# EAGLE design hvac-sensors-v3 (EAGLE 6.4)
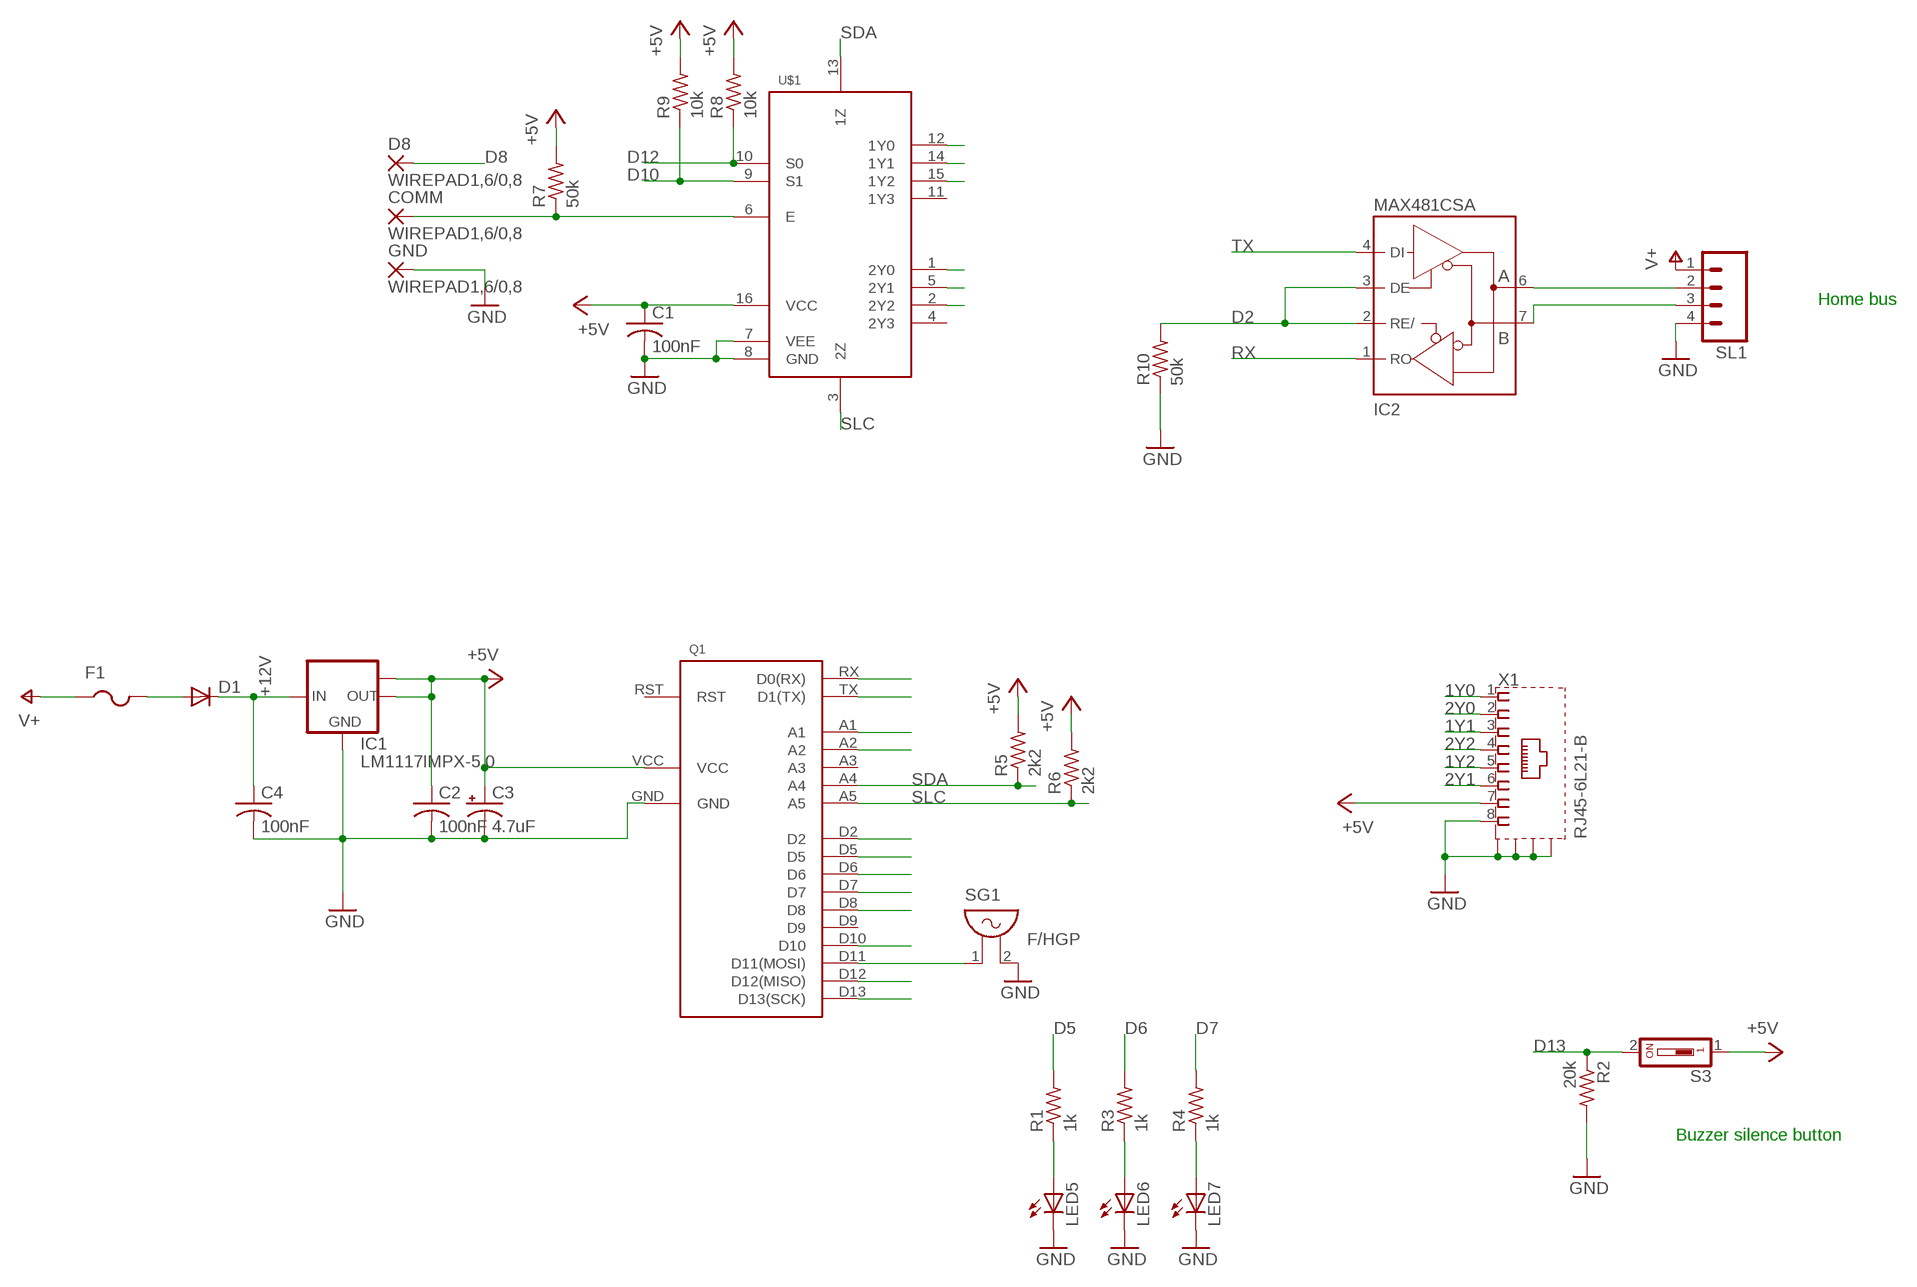
[diagram p0: schematic, sheet 1]

## Parts
C1  100nF  C-USC0603K  [C0603K]
C2  100nF  C-USC0603K  [C0603K]
C3  4.7uF  CPOL-USE1.8-4  [E1,8-4]
C4  100nF  C-USC0603K  [C0603K]
COMM  WIREPAD1,6/0,8  [1,6/0,8]
D1  DIODE-MICROMELF-W  [MICROMELF-W]
D8  WIREPAD1,6/0,8  [1,6/0,8]
F1  PTCFUSE-1812  [1812]
GND  WIREPAD1,6/0,8  [1,6/0,8]
IC1  LM1117IMPX-5.0  [SOT223]
IC2  MAX481CSA  [SO08]
LED5  LED5MM  [LED5MM]
LED6  LED5MM  [LED5MM]
LED7  LED5MM  [LED5MM]
Q1  HOME-CPU-V1  [HOME-CPU-V1]
R1  1k  R-US_R0603  [R0603]
R2  20k  R-US_R0603  [R0603]
R3  1k  R-US_R0603  [R0603]
R4  1k  R-US_R0603  [R0603]
R5  2k2  R-US_R0603  [R0603]
R6  2k2  R-US_R0603  [R0603]
R7  50k  R-US_R0603  [R0603]
R8  10k  R-US_R0603  [R0603]
R9  10k  R-US_R0603  [R0603]
R10  50k  R-US_R0603  [R0603]
S3  DS01  [DS-01]
SG1  F/HGP  [F/HGP]
SL1  M04  [04P]
U$1  74HC4052SO-16  [SO16]
X1  RJ45-6L21-B  [RJ45-SHIELD1]

## Nets
1Y0: U$1.12(1Y0) X1.1
1Y1: U$1.14(1Y1) X1.3
1Y2: U$1.15(1Y2) X1.5
2Y0: U$1.1(2Y0) X1.2
2Y1: U$1.5(2Y1) X1.6
2Y2: U$1.2(2Y2) X1.4
+12V: C4.1 D1.C IC1.3(IN)
A1: Q1.A1
A2: Q1.A2
D2: IC2.2(RE/) IC2.3(DE) Q1.D2 R10.2
D5: Q1.D5 R1.2
D6: Q1.D6 R3.2
D7: Q1.D7 R4.2
D8: D8.1(P) Q1.D8
D10: Q1.D10 R9.1 U$1.9(S1)
D11: Q1.D11(D11(MOSI)) SG1.1
D12: Q1.D12(D12(MISO)) R8.1 U$1.10(S0)
D13: Q1.D13(D13(SCK)) R2.1 S3.2
GND: C1.2 C2.2 C3.- C4.2 GND.1(P) IC1.1(GND) LED5.K(C) LED6.K(C) LED7.K(C) Q1.GND R2.2 R10.1 SG1.2 SL1.4 U$1.7(VEE) U$1.8(GND) X1.8 X1.S1(S) X1.S2(S) X1.S3(S) X1.S4(S)
N$1: D1.A F1.2
N$3: IC2.6(A) SL1.2
N$4: IC2.7(B) SL1.3
N$14: COMM.1(P) R7.1 U$1.6(E)
N$16: LED5.A R1.1
N$17: LED6.A R3.1
N$18: LED7.A R4.1
RX: IC2.1(RO) Q1.RX(D0(RX))
SDA: Q1.A4 R5.1 U$1.13(1Z)
SLC: Q1.A5 R6.1 U$1.3(2Z)
TX: IC2.4(DI) Q1.TX(D1(TX))
V+: F1.1 SL1.1
VCC: C1.1 C2.1 C3.+ IC1.2(OUT) IC1.TAB(OUT1) Q1.VCC R5.2 R6.2 R7.2 R8.2 R9.2 S3.1 U$1.16(VCC) X1.7 ; supply symbol labelled +5V
Unconnected: Q1.A3 Q1.D9 Q1.RST U$1.4(2Y3) U$1.11(1Y3)

## Notes on the sheet
- Home bus
- Buzzer silence button

## Power pins joined to a net without a drawn wire
GND: IC2.5(GND)
VCC: IC2.8(VCC)

## Library data of the parts
C1 C2 C4 = adafruit:C-US: CAPACITOR, American symbol
C3 = adafruit:CPOL-US: POLARIZED CAPACITOR, American symbol
COMM D8 GND = wirepad:WIREPAD: Wire PAD connect wire on PCB
D1 = diode:DIODE-: DIODE
F1 = adafruit:PTCFUSE: PTC fuses, resettable thermistors
IC1 = lm1117:LM1117IMPX-*
IC2 = maxim:MAX481CSA: RS485 TRANSEIVER; MF: MAXIM; MPN: MAX481CSA; OC_FARNELL: unknown; OC_NEWARK: 90C3817
LED5-LED7 = adafruit:LED: LED OSRAM: - CHIPLED LG R971, LG N971, LY N971, LG Q971, LY Q971, LO R971, LY R971 LH N974, LH R974 LS Q976, LO Q976, LY Q976 LO Q996 - Hyper CHIPLED LW Q18S LB Q993, LB Q99A, LB R99A - SideLED LS A670, LO A670, LY A670, LG A670, LP A670 LB A673, LV A673, LT A673, LW A673 LH A674 LY A675 LS A676, LA A676, LO A676, LY A676, LW A676 LS A679, LY A679, LG A679 - Hyper Micro SIDELED® LS Y876, LA Y876, LO Y876, LY Y876 LT Y87S - SmartLED LW L88C, LW L88S LB L89C, LB L89S, LG L890 LS L89K, LO L89K, LY L89K LS L896, LA L896, LO L896, LY L896 - TOPLED LS T670, LO T670, LY T670, LG T670, LP T670 LSG T670, LSP T670, LSY T670, LOP T670, LYG T670 LG T671, LOG T671, LSG T671 LB T673, LV T673, LT T673, LW T673 LH T674 LS T676, LA T676, LO T676, LY T676, LB T676, LH T676, LSB T676, LW T676 LB T67C, LV T67C, LT T67C, LS T67K, LO T67K, LY T67K, LW E67C LS E67B, LA E67B, LO E67B, LY E67B, LB E67C, LV E67C, LT E67C LW T67C LS T679, LY T679, LG T679 LS T770, LO T770, LY T770, LG T770, LP T770 LB T773, LV T773, LT T773, LW T773 LH T774 LS E675, LA E675, LY E675, LS T675 LS T776, LA T776, LO T776, LY T776, LB T776 LHGB T686 LT T68C, LB T68C - Hyper Mini TOPLED® LB M676 - Mini TOPLED Santana® LG M470 LS M47K, LO M47K, LY M47K Source: http://www.osram.convergy.de/
Q1 = serge:HOME-CPU-V1
R1-R10 = adafruit:R-US_: RESISTOR, American symbol
S3 = switch-dil:DS01: DIL/CODE SWITCH; OC_FARNELL: unknown; OC_NEWARK: unknown
SG1 = buzzer:F/HGP: BUZZER Source: Buerklin; OC_FARNELL: unknown; OC_NEWARK: unknown
SL1 = con-amp-quick:M04: AMP QUICK CONNECTOR; OC_FARNELL: unknown; OC_NEWARK: unknown
U$1 = serge:74HC4052
X1 = con-tycoelectronics:RJ45*2: RJ45 Low Profile Shield Type 2 For all RJ45 L, LC, LCT and X Series Models Source: www.tycoelectronics.com .. ENG_DS_1654001_1099_RJ_L_0507.pdf; OC_FARNELL: unknown; OC_NEWARK: unknown

## Board
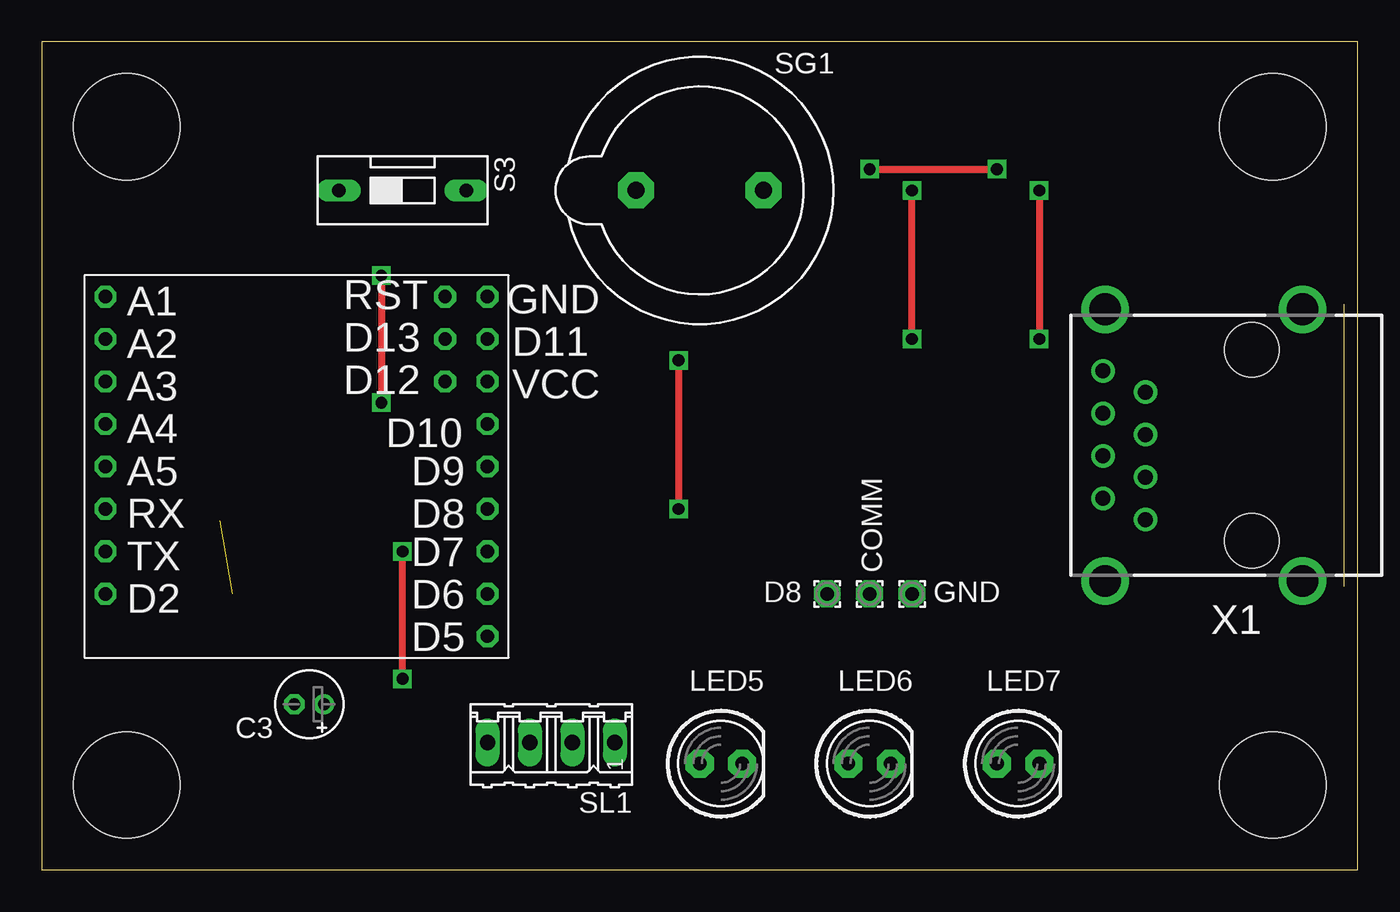
[diagram p1: board, top side]
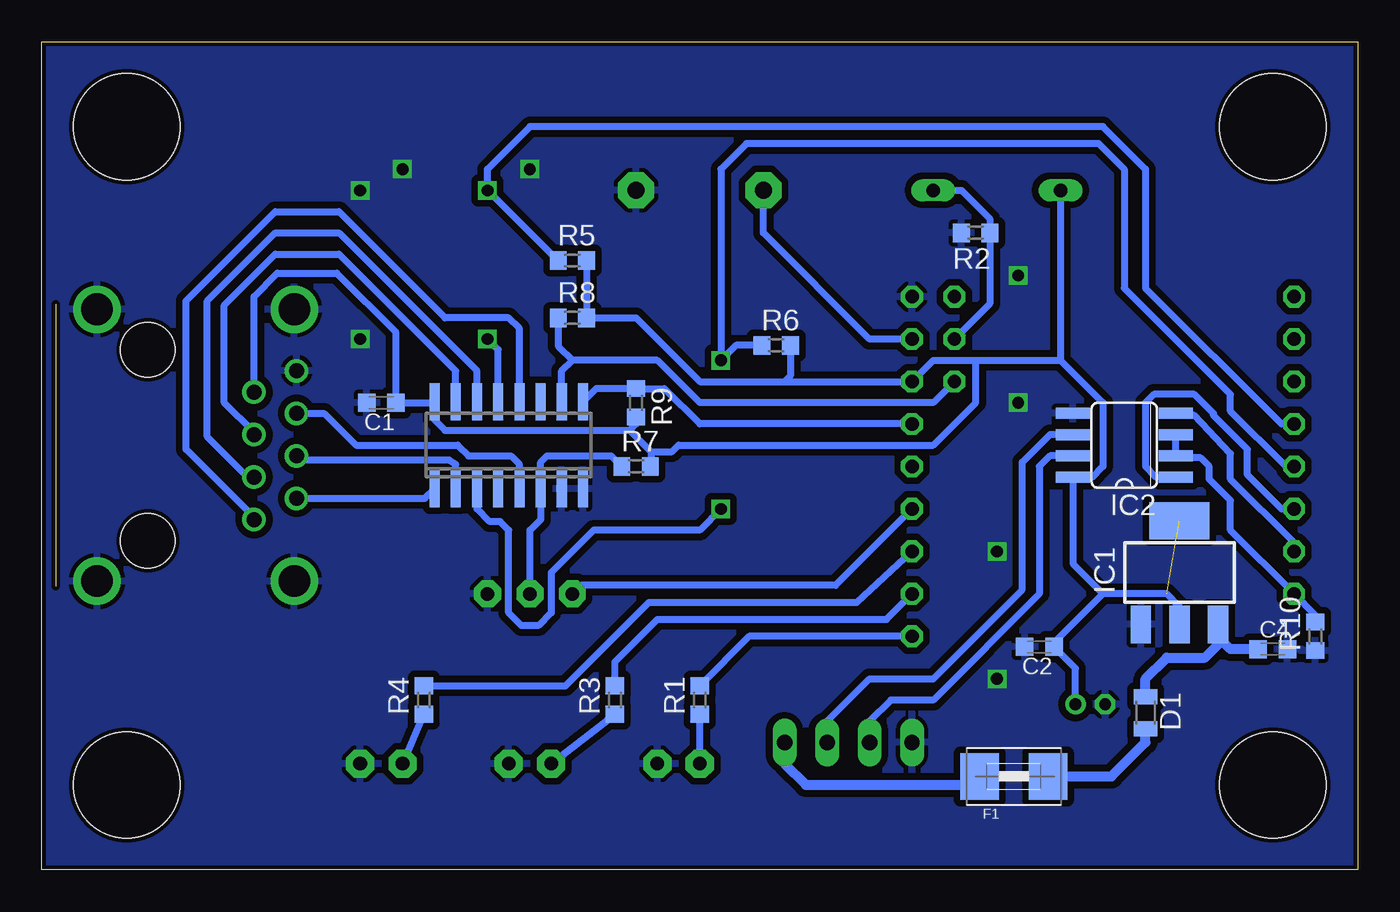
[diagram p2: board, bottom side, seen from below]

Size 78.74 x 49.53 mm. Coordinates in mm from the lower left corner, seen from the top.
Outline: 0,0 78.74,0 78.74,49.53 0,49.53 0,0
Copper layers (1*16): Top 0.035mm / dielectric 1.5mm / Bottom 0.035mm
Design rules "default *": minimum track width 10mil, minimum drill 24mil, track to track 16mil, track to pad 16mil, pad to pad 16mil, via to via 16mil, smd to smd 16mil, copper to edge 10mil, drill to drill 8mil, minimum pad ring 10mil, minimum via ring 8mil, stop-mask expansion 4mil, vias tented up to drill 0mil, thermal gap 10mil
Holes 6.35 mm at 73.66,5.08 73.66,44.45 5.08,44.45 5.08,5.08

### Footprints (pad centres in the part's own frame; a part is rotated, then mirrored left to right if it is on the bottom)
C0603K = smd 1.05 x 1.08: 1 -0.875,0; 2 0.875,0
E1,8-4 = drill 0.711 pad 1.168: + -0.889,0 | drill 0.711 pad 1.168 octagon: - 0.889,0
1,6/0,8 = drill 0.813 pad 1.6 octagon: 1 0,0
MICROMELF-W = smd 0.9 x 1.4: A 0.95,0; C -0.95,0
1812 = smd 2.286 x 2.794: 1 -2.046,0; 2 2.046,0
SOT223 = smd 1.219 x 2.235: 1 -2.311,-3.099; 2 0,-3.099; 3 2.311,-3.099 | smd 3.6 x 2.2: TAB 0,3.099
SO08 = smd 0.66 x 2.032: 1 -1.905,-3.073; 2 -0.635,-3.073; 3 0.635,-3.073; 4 1.905,-3.073; 5 1.905,3.073; 6 0.635,3.073; 7 -0.635,3.073; 8 -1.905,3.073
LED5MM = drill 0.813 pad 1.676 octagon: A -1.27,0; K 1.27,0
HOME-CPU-V1 = drill 0.8 octagon: A1 5.08,22.86; A2 2.54,22.86; A3 0,22.86; A4 -2.54,22.86; A5 -5.08,22.86; D2 -12.7,22.86; D5 -15.24,0; D6 -12.7,0; D7 -10.16,0; D8 -7.62,0; D9 -5.08,0; D10 -2.54,0; D11 2.54,0; D12 0,2.54; D13 2.54,2.54; GND 5.08,0; RST 5.08,2.54; RX -7.62,22.86; TX -10.16,22.86; VCC 0,0
R0603 = smd 1 x 1.1: 1 -0.85,0; 2 0.85,0
DS-01 = drill 0.813 long: 1 0,-3.81; 2 0,3.81
F/HGP = drill 1.016 pad 2.159 octagon: 1 -3.81,0; 2 3.81,0
04P = drill 0.914 long: 1 -3.81,0; 2 -1.27,0; 3 1.27,0; 4 3.81,0
SO16 = smd 0.6 x 2.2: 1 -4.445,-2.6; 2 -3.175,-2.6; 3 -1.905,-2.6; 4 -0.635,-2.6; 5 0.635,-2.6; 6 1.905,-2.6; 7 3.175,-2.6; 8 4.445,-2.6; 9 4.445,2.6; 10 3.175,2.6; 11 1.905,2.6; 12 0.635,2.6; 13 -0.635,2.6; 14 -1.905,2.6; 15 -3.175,2.6; 16 -4.445,2.6
RJ45-SHIELD1 = drill 0.9 pad 1.4: 1 -4.445,6.35; 2 -3.175,8.89; 3 -1.905,6.35; 4 -0.635,8.89; 5 0.635,6.35; 6 1.905,8.89; 7 3.175,6.35; 8 4.445,8.89 | drill 1.9 pad 2.5: S1 -8.128,-3.048; S2 8.128,-3.048; S3 -8.128,8.76; S4 8.128,8.76 | hole 3.251: -5.715,0; 5.715,0

### Placement (x,y rotation side)
C1  58.42,27.94 180 bottom
C2  19.05,13.34 180 bottom
C3  16,9.91 180 top
C4  5.08,13.21 0 bottom
COMM  49.53,16.51 0 top
D1  12.7,9.4 270 bottom
D8  46.99,16.51 0 top
F1  20.57,5.59 0 bottom
GND  52.07,16.51 0 top
IC1  10.67,17.78 0 bottom
IC2  13.97,25.4 90 bottom
LED5  40.64,6.35 0 top
LED6  49.53,6.35 0 top
LED7  58.42,6.35 0 top
Q1  26.67,29.21 90 top
R1  39.37,10.16 90 bottom
R2  22.86,38.1 180 bottom
R3  44.45,10.16 90 bottom
R4  55.88,10.16 90 bottom
R5  46.99,36.45 0 bottom
R6  34.8,31.37 0 bottom
R7  43.18,24.13 0 bottom
R8  46.99,33.02 0 bottom
R9  43.18,27.94 270 bottom
R10  2.54,13.97 90 bottom
S3  21.59,40.64 270 top
SG1  39.37,40.64 0 top
SL1  30.48,7.62 180 top
U$1  50.8,25.4 0 bottom
X1  72.39,25.4 90 top

### Tracks (layer width: path | path; a pad name or v marks a point on that pad's centre or on a via)
1Y0
  Bottom 0.406: X1.1 66.04,21.08 70.1,25.15 70.1,34.04 64.77,39.37 60.96,39.37 54.61,33.02 50.8,33.02 50.16,32.38 U$1.12
1Y1
  Bottom 0.406: X1.3 66.42,23.5 68.83,25.91 68.83,34.04 64.77,38.1 60.96,38.1 52.7,29.84 U$1.14
1Y2
  Bottom 0.406: X1.5 66.04,26.16 67.82,27.94 67.82,33.78 64.77,36.83 60.96,36.83 53.98,29.84 U$1.15
2Y0
  Bottom 0.406: X1.2 55.82,22.23 U$1.1
2Y1
  Bottom 0.406: X1.6 61.85,27.3 59.94,25.4 53.85,25.4 53.21,24.77 50.67,24.77 50.16,24.26 U$1.5
2Y2
  Bottom 0.406: U$1.2 53.98,24.26 54.36,24.51 63.12,24.51 X1.4
+12V
  Bottom 0.61: D1.C 12.7,11.43 11.43,12.7 9.14,12.7 8.38,13.46 8.38,13.97 | 8.38,13.97 8.38,14.66 IC1.3 | C4.1 7.62,13.21 8.38,13.97
D2
  Bottom 0.406: IC2.3 IC2.2 10.77,24.64 9.4,24.64 8.89,24.13 8.89,23.37 7.62,22.1 7.62,20.32 Q1.D2 2.54,15.24 R10.2
D5
  Bottom 0.406: Q1.D5 36.41,13.97 R1.2
D6
  Bottom 0.406: Q1.D6 28.19,14.99 41.91,14.99 44.45,12.45 R3.2
D7
  Bottom 0.406: R4.2 47.41,11.01 42.42,16 29.97,16 Q1.D7
D8
  Bottom 0.406: Q1.D8 31.24,17.02 46.48,17.02 D8.1
D10
  Bottom 0.406: Q1.D10 39.37,26.67 41.49,28.79 R9.1 45.56,28.79 U$1.9 46.3,27.94
D11
  Bottom 0.406: Q1.D11 29.21,31.75 35.56,38.1 SG1.1
D12
  Bottom 0.406: Q1.D12 25.4,27.94 39.37,27.94 41.91,30.48 46.99,30.48 | U$1.10 47.62,29.84 46.99,30.48 | R8.1 47.84,31.33 46.99,30.48
D13
  Bottom 0.406: Q1.D13 22.01,33.87 R2.1 22.01,38.95 23.7,40.64 S3.2
GND  (via drill 0.7)
  Top 0.406: v21.59,11.43 v21.59,19.05 | v20.32,35.56 v20.32,27.94 | v59.69,40.64 v59.69,31.75 | v49.53,41.91 v57.15,41.91
  pour Bottom: 78.74,0 0,0 0,49.53 78.74,49.53
N$1
  Bottom 0.61: F1.2 14.73,5.59 12.7,7.62 D1.A
N$3
  Bottom 0.406: IC2.6 18.41,26.04 20.07,24.38 20.07,16.76 25.4,11.43 29.21,11.43 31.75,8.89 SL1.2
N$4
  Bottom 0.406: IC2.7 18.41,24.77 19.05,24.13 19.05,16.51 25.4,10.16 27.94,10.16 29.21,8.89 SL1.3
N$14
  Bottom 0.406: R7.1 44.66,24.77 48.51,24.77 48.9,24.38 U$1.6 48.9,20.95 49.53,20.32 COMM.1
N$16
  Bottom 0.406: LED5.A R1.1
N$17
  Bottom 0.406: LED6.A R3.1
N$18
  Bottom 0.406: LED7.A R4.1
RX
  Bottom 0.406: Q1.RX 4.57,21.59 6.6,23.62 6.6,25.15 8.64,27.18 8.64,27.3 9.78,28.45 12.19,28.45 12.7,27.94 12.7,24.13 12.06,23.5 IC2.1
SDA  (via drill 0.7)
  Top 0.406: v52.07,31.75 v52.07,40.64
  Bottom 0.406: Q1.A4 4.57,26.67 12.7,34.8 12.7,41.91 15.24,44.45 49.53,44.45 52.07,41.91 v52.07,40.64 47.88,36.45 R5.1 | U$1.13 51.44,31.11 v52.07,31.75
SLC  (via drill 0.7)
  Top 0.406: v38.1,30.48 v38.1,21.59
  Bottom 0.406: Q1.A5 4.32,24.13 7.62,27.43 7.62,28.45 13.97,34.8 13.97,41.91 15.49,43.43 36.58,43.43 38.1,41.91 v38.1,30.48 37.21,31.37 R6.1 | v38.1,21.59 39.37,20.32 45.72,20.32 48.26,17.78 48.26,15.37 49.02,14.61 50.04,14.61 50.8,15.37 50.8,20.32 51.31,20.83 51.94,20.83 52.7,21.59 U$1.3
TX
  Bottom 0.406: Q1.TX 3.81,19.56 7.62,23.37 7.62,24.89 9.78,27.18 10.77,27.18 IC2.4
V+
  Bottom 0.61: SL1.1 34.29,6.35 33.02,5.08 23.13,5.08 F1.1
VCC  (1 unrouted)
  Bottom 0.406: 22.86,30.48 25.4,30.48 Q1.VCC 34.29,29.21 | 22.86,30.48 17.78,30.48 | 17.78,30.48 15.24,27.94 15.24,24.13 15.88,23.5 IC2.8 17.04,18.31 15.24,16.51 | IC1.2 10.67,15.75 11.43,16.51 15.24,16.51 | 43.56,26.29 54.61,26.29 55.24,26.92 U$1.16 55.3,27.94 C1.1 57.55,32.15 61.09,35.69 64.64,35.69 66.04,34.29 X1.7 | 43.56,26.29 42.29,25.02 | 42.29,25.02 42.29,24.17 R7.2 | 42.29,25.02 41.02,25.02 40.64,25.4 25.4,25.4 22.86,27.94 22.86,30.48 | 34.29,29.21 39.37,29.21 43.18,33.02 R8.2 R5.2 | S3.1 17.78,30.48 | R6.2 33.95,29.55 34.29,29.21 | 15.24,16.51 18.18,13.57 C2.1 16.89,12.05 C3.+ | R9.2 43.18,26.67 43.56,26.29